# EAGLE schematic ESP32 Display-1.46-V1.0 (EAGLE 9.6.2)
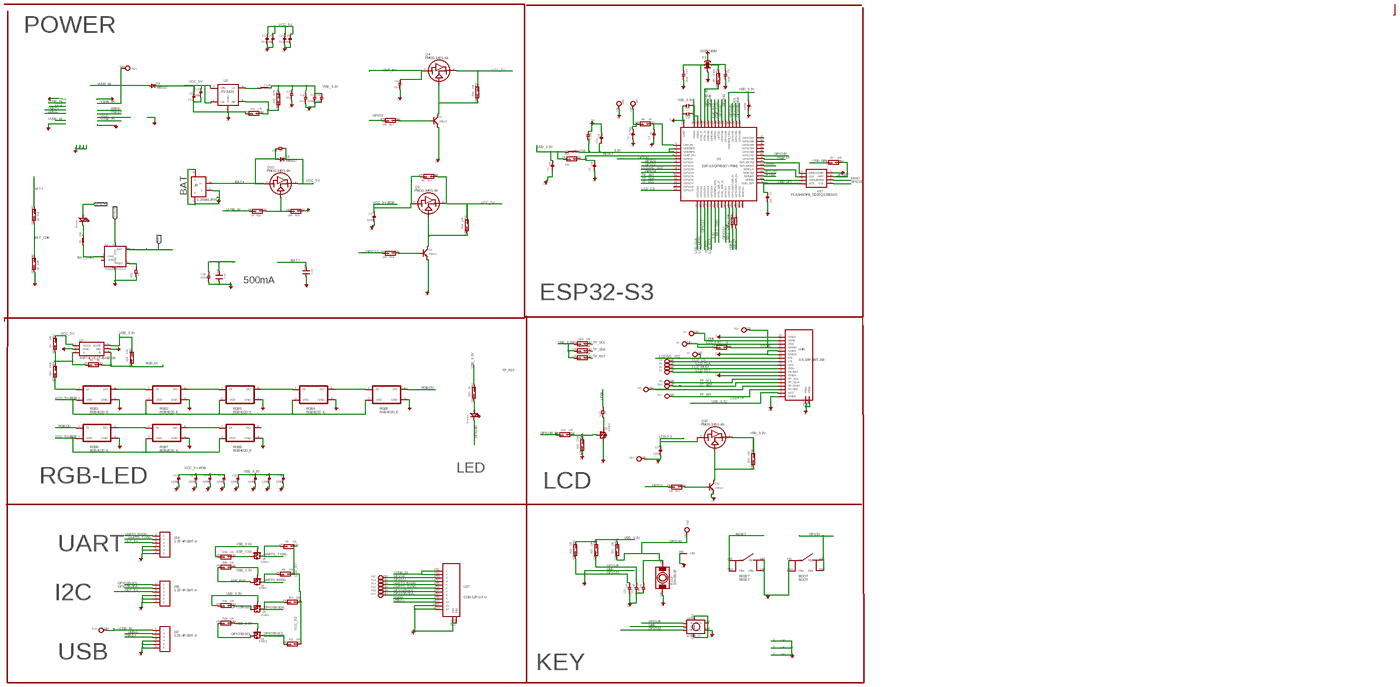
[diagram p0: schematic, sheet 1, overview]
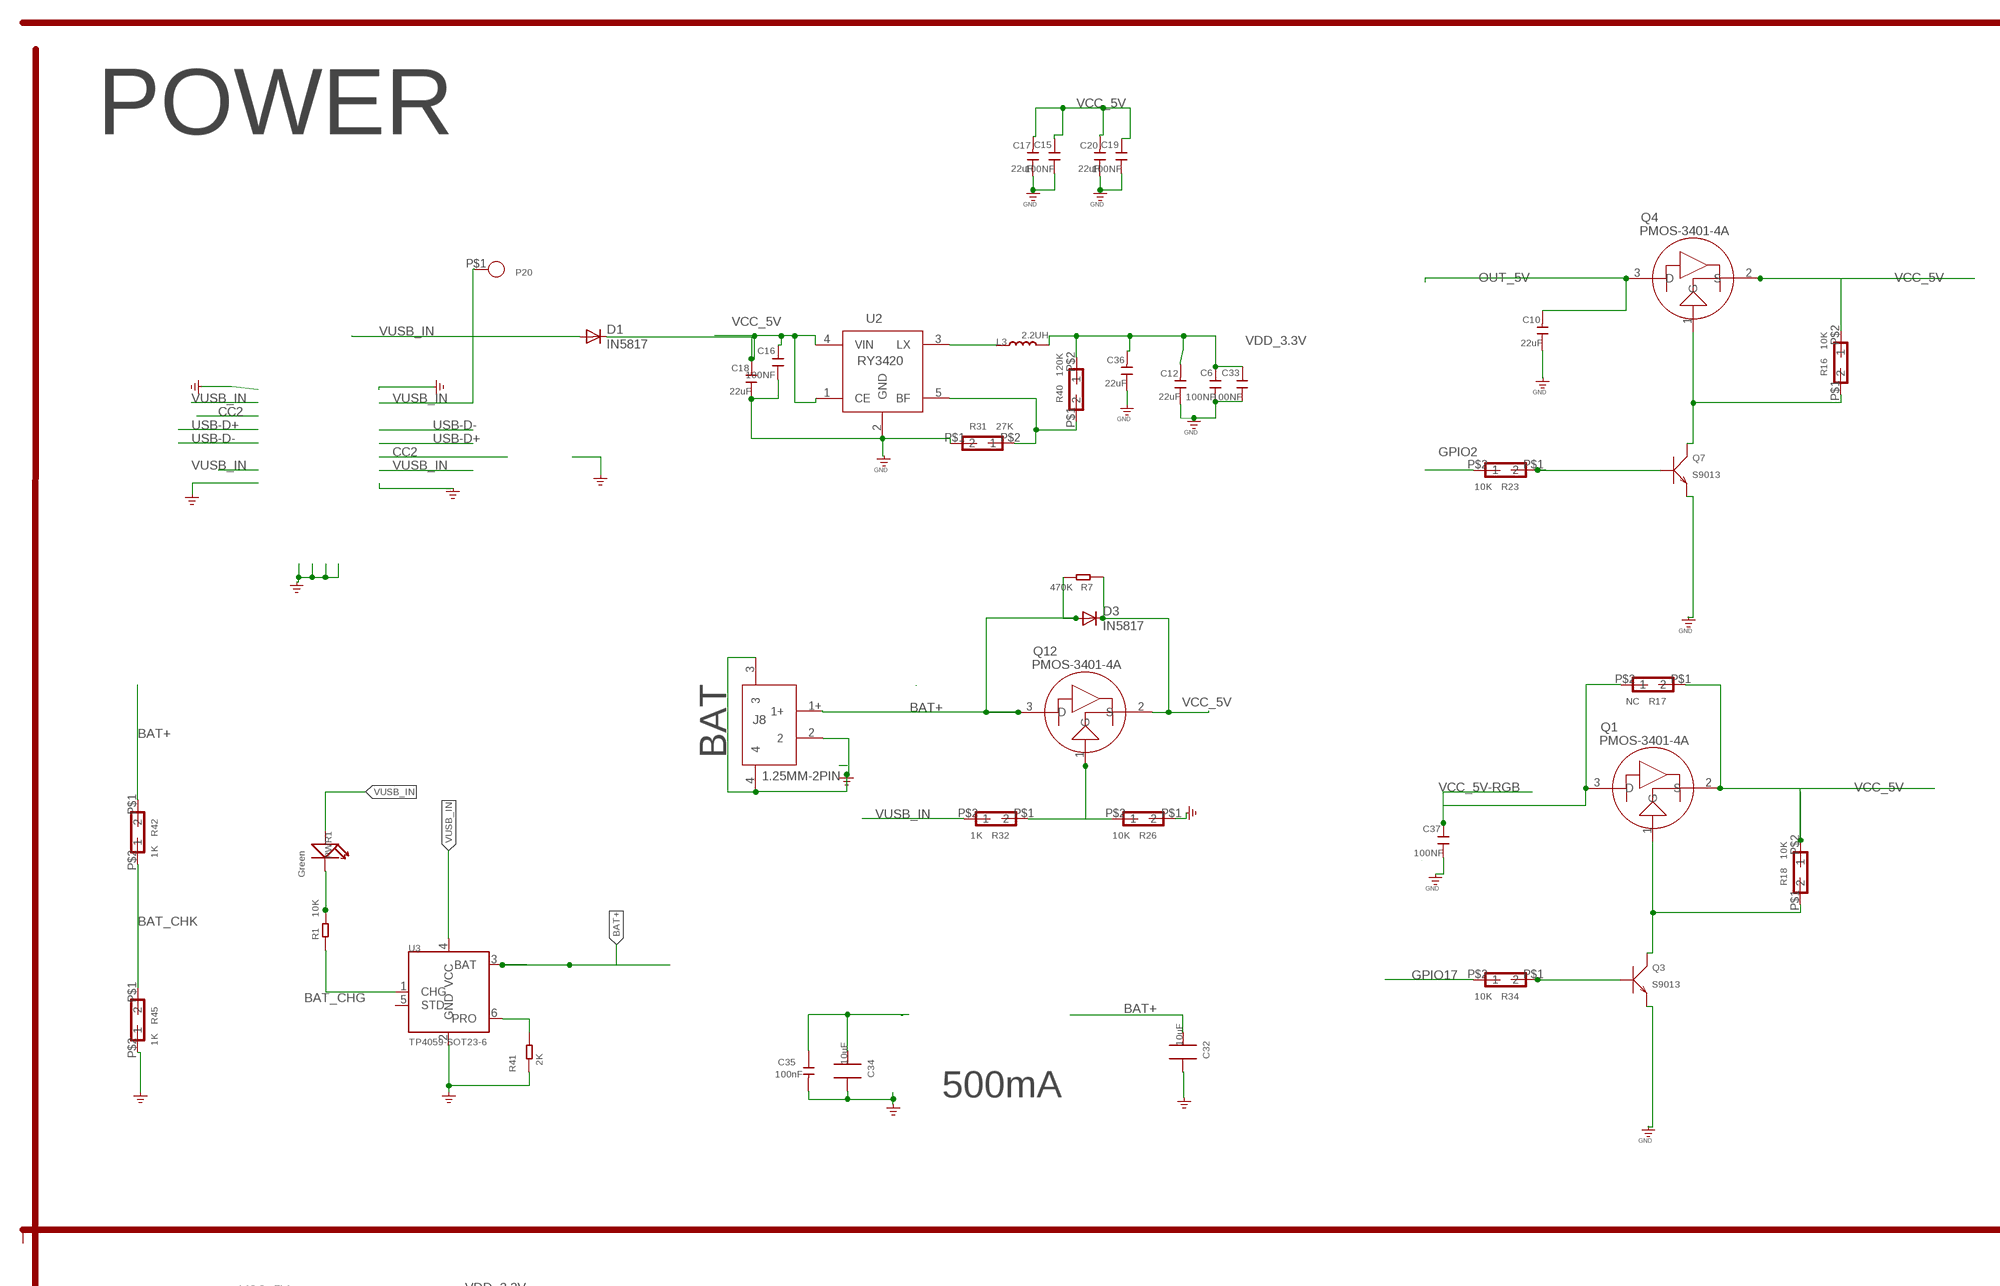
[diagram p1: schematic, sheet 1, part 1 of 5]
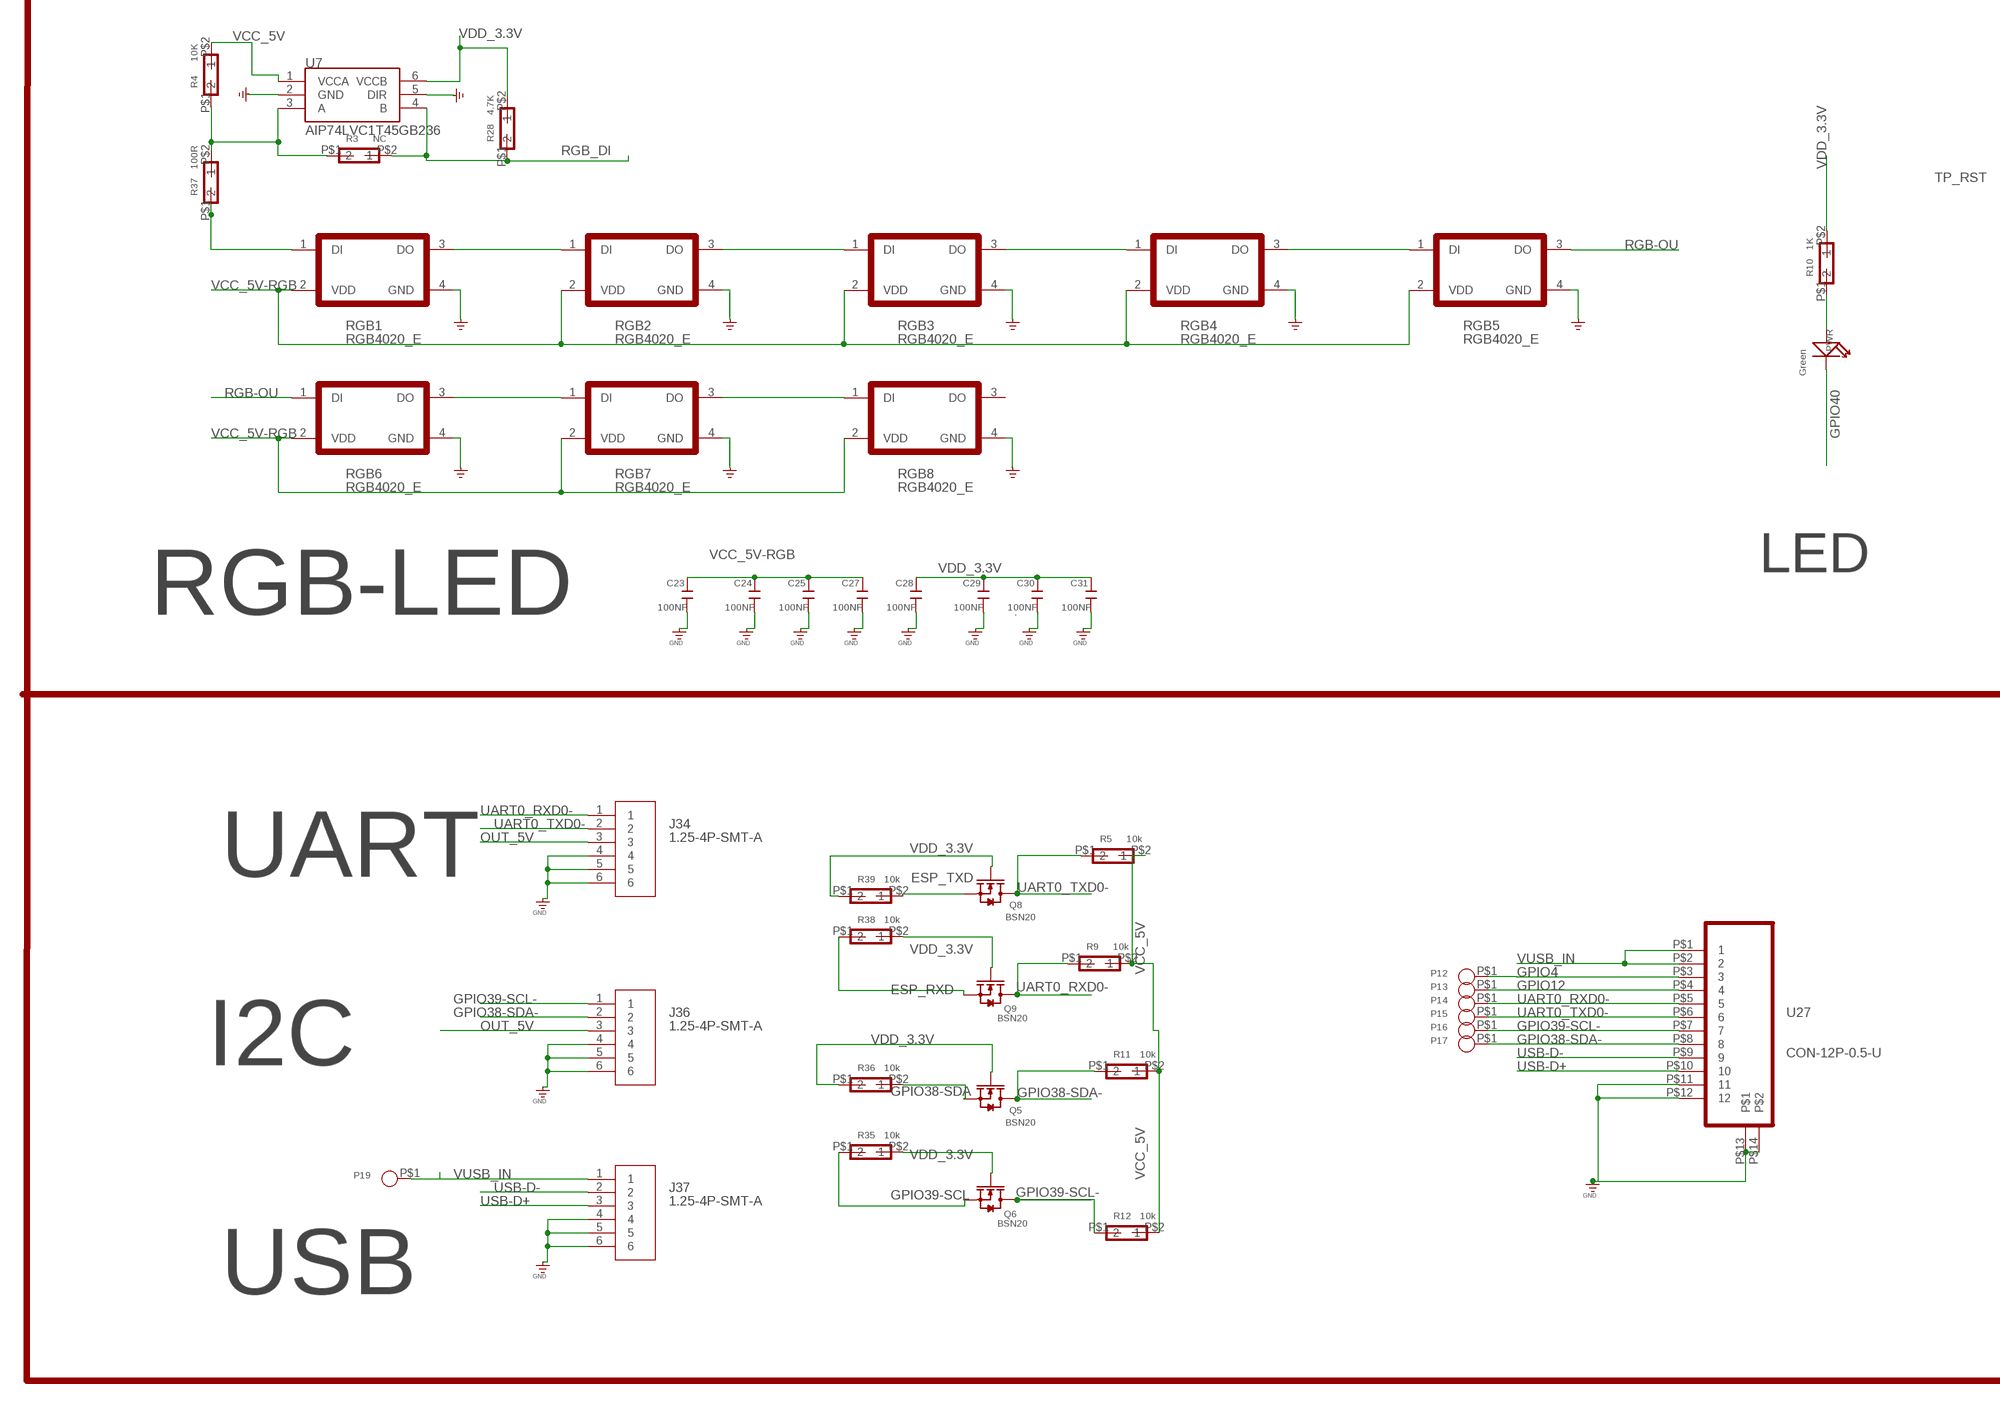
[diagram p2: schematic, sheet 1, part 2 of 5]
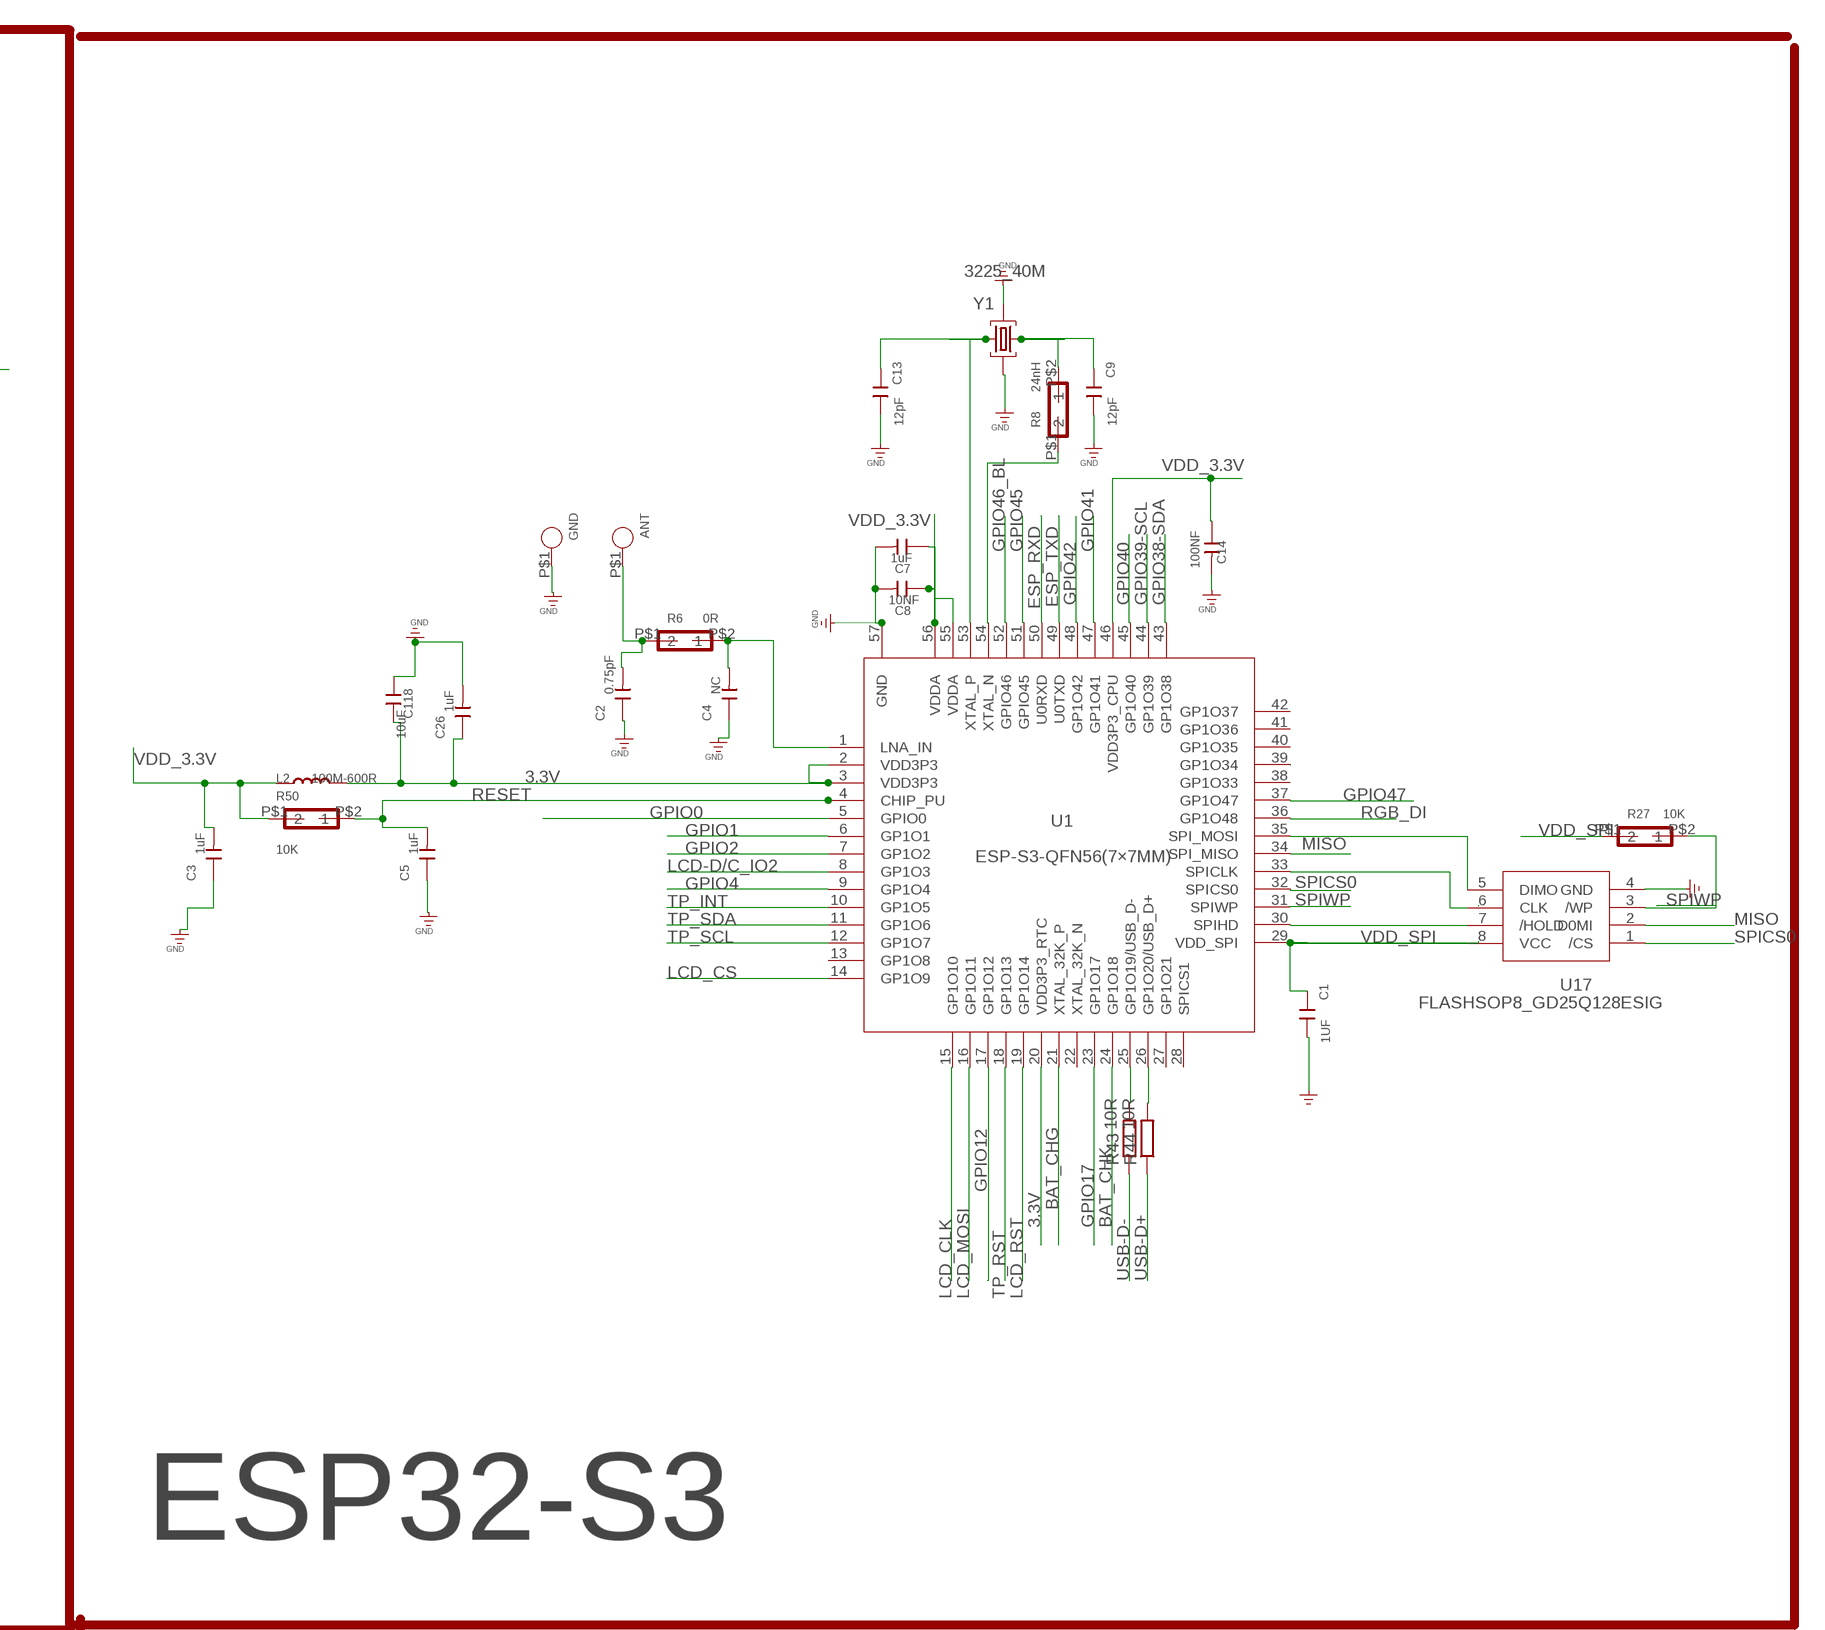
[diagram p3: schematic, sheet 1, part 3 of 5]
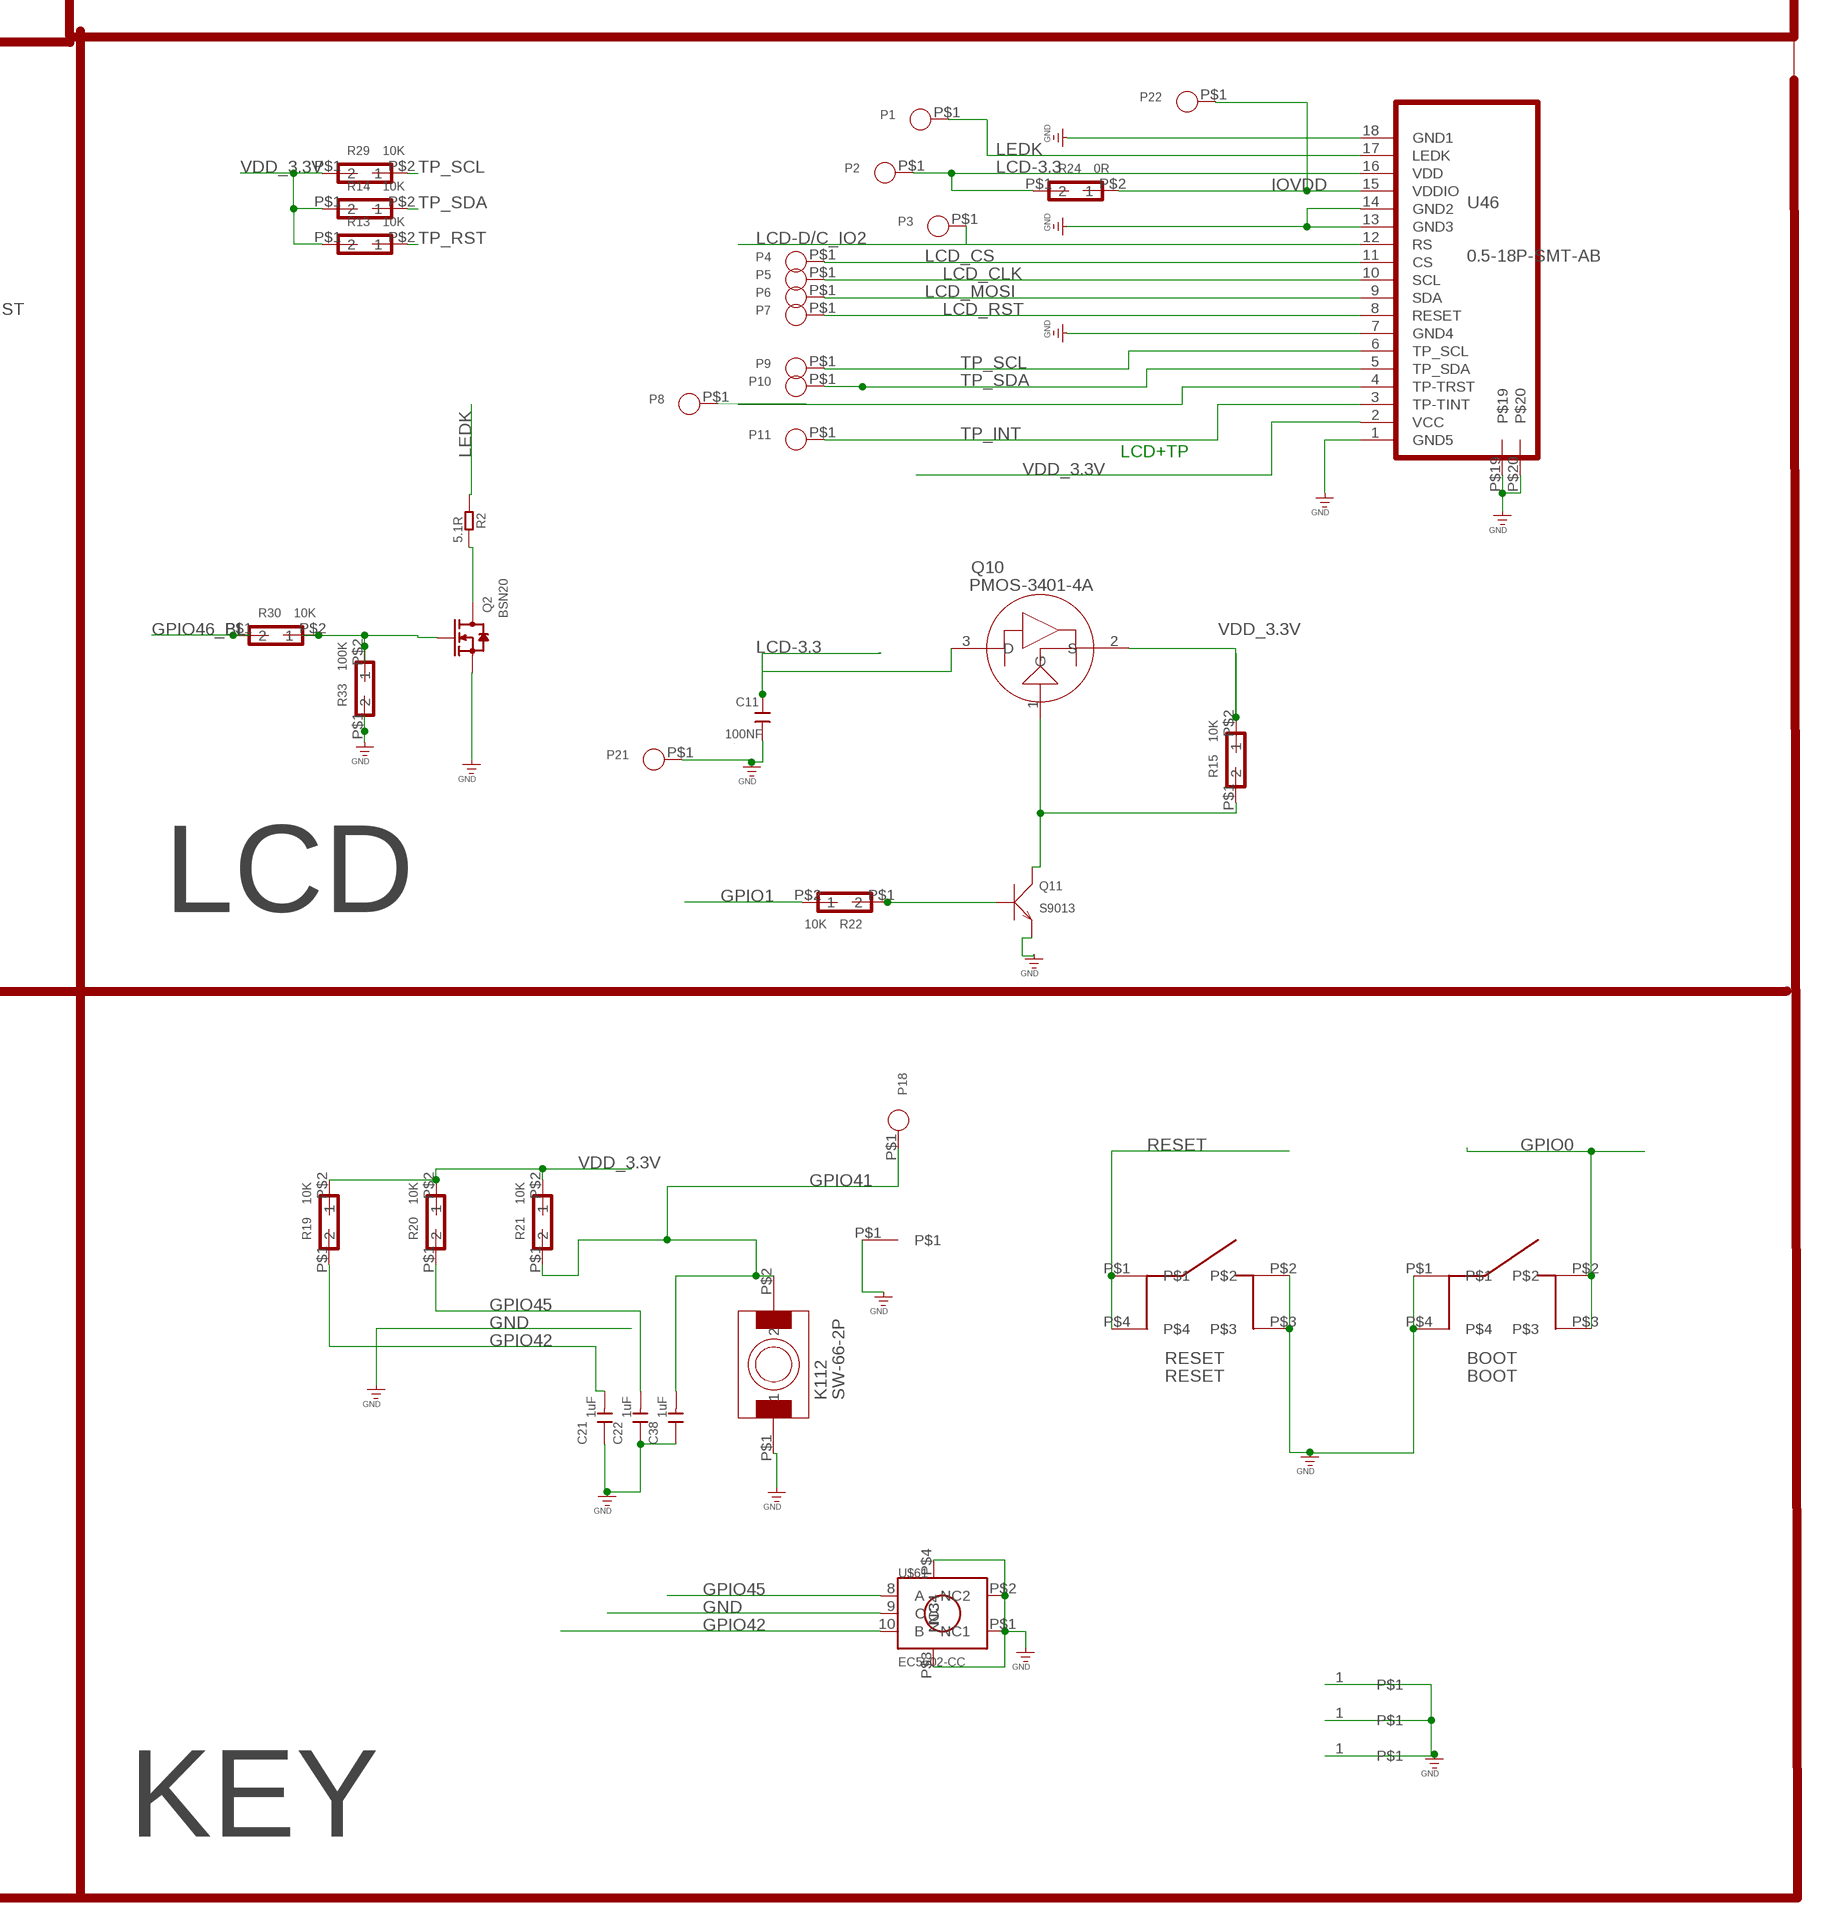
[diagram p4: schematic, sheet 1, part 4 of 5]
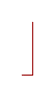
[diagram p5: schematic, sheet 1, part 5 of 5]

## Parts
ANT  TEST_PADPAD-1.5MM  [TEST_PAD-1.5MM]
BOOT  BOOT  SW-4  [SW-4.5*4.5]
C1  1UF  C0402_W  [0402]
C2  0.75pF  CAPC0402-1  [C0402]
C3  1uF  CAPC0402-1  [C0402]
C4  NC  CAPC0402-1  [C0402]
C5  1uF  CAPC0402-1  [C0402]
C6  100NF  C0603  [0603]
C7  1uF  C-0603  [C0603]
C8  10NF  C-0603  [C0603]
C9  12pF  C0402_W  [0402]
C10  22uF  C0805  [0805]
C11  100NF  C0603  [0603]
C12  22uF  C0805  [0805]
C13  12pF  C0402_W  [0402]
C14  100NF  C-0603  [C0603]
C15  100NF  C0603  [0603]
C16  100NF  C0603  [0603]
C17  22uF  C0805  [0805]
C18  22uF  C0805  [0805]
C19  100NF  C0603  [0603]
C20  22uF  C0805  [0805]
C21  1uF  CAPC0402-1  [C0402]
C22  1uF  CAPC0402-1  [C0402]
C23  100NF  C0603  [0603]
C24  100NF  C0603  [0603]
C25  100NF  C0603  [0603]
C26  1uF  CAPC0402-1  [C0402]
C27  100NF  C0603  [0603]
C28  100NF  C0603  [0603]
C29  100NF  C0603  [0603]
C30  100NF  C0603  [0603]
C31  100NF  C0603  [0603]
C32  10uF  C0805_S  [0805_S]
C33  100NF  C0603  [0603]
C34  10uF  C0805_S  [0805_S]
C35  100nF  C-0603  [C0603]
C36  22uF  C0805  [0805]
C37  100NF  C0603  [0603]
C38  1uF  CAPC0402-1  [C0402]
C118  10uF  C0603  [0603]
D1  IN5817  DIODE-DO-214AC  [DO-214AC]
D3  IN5817  DIODE-DO-214AC  [DO-214AC]
GND  TEST_PADPAD-1.5MM  [TEST_PAD-1.5MM]
J8  1.25MM-2PIN  CROWBOT-V1.0库_1.25MM-2PIN  [CROWBOT-V1.0库_1.25MM-2PIN]
J34  1.25-4P-SMT-A  [1.25-4P立贴]
J36  1.25-4P-SMT-A  [1.25-4P立贴]
J37  1.25-4P-SMT-A  [1.25-4P立贴]
K112  SW-66-2P  [CROWPI_POW_BUTTON_2P]
L2  100M-600R  L0603  [L0603]
L3  2.2UH  LL0420  [L0420]
P1  PADPAD-1.0MM  [PAD-1.0MM]
P2  PADPAD-1.0MM  [PAD-1.0MM]
P3  PADPAD-1.0MM  [PAD-1.0MM]
P4  PADPAD-1.0MM  [PAD-1.0MM]
P5  PADPAD-1.0MM  [PAD-1.0MM]
P6  PADPAD-1.0MM  [PAD-1.0MM]
P7  PADPAD-1.0MM  [PAD-1.0MM]
P8  PADPAD-1.0MM  [PAD-1.0MM]
P9  PADPAD-1.0MM  [PAD-1.0MM]
P10  PADPAD-1.0MM  [PAD-1.0MM]
P11  PADPAD-1.0MM  [PAD-1.0MM]
P12  PADPAD-1.0MM  [PAD-1.0MM]
P13  PADPAD-1.0MM  [PAD-1.0MM]
P14  PADPAD-1.0MM  [PAD-1.0MM]
P15  PADPAD-1.0MM  [PAD-1.0MM]
P16  PADPAD-1.0MM  [PAD-1.0MM]
P17  PADPAD-1.0MM  [PAD-1.0MM]
P18  PADPAD-1.0MM  [PAD-1.0MM]
P19  PADPAD-1.0MM  [PAD-1.0MM]
P20  PADPAD-1.0MM  [PAD-1.0MM]
P21  PADPAD-1.0MM  [PAD-1.0MM]
P22  PADPAD-1.0MM  [PAD-1.0MM]
PWR  Green  LED'0603'  [LED-0603]
PWR1  Green  LED'0603'  [LED-0603]
Q1  PMOS-3401-4A  P-MOS-SOT23  [SOT-23]
Q2  BSN20  MOSFET-N'SOT23'  [SOT23]
Q3  S9013  TRANSISTOR-NPN-SOT23  [SOT23@1]
Q4  PMOS-3401-4A  P-MOS-SOT23  [SOT-23]
Q5  BSN20  MOSFET-N'SOT23'  [SOT23]
Q6  BSN20  MOSFET-N'SOT23'  [SOT23]
Q7  S9013  TRANSISTOR-NPN-SOT23  [SOT23@1]
Q8  BSN20  MOSFET-N'SOT23'  [SOT23]
Q9  BSN20  MOSFET-N'SOT23'  [SOT23]
Q10  PMOS-3401-4A  P-MOS-SOT23  [SOT-23]
Q11  S9013  TRANSISTOR-NPN-SOT23  [SOT23@1]
Q12  PMOS-3401-4A  P-MOS-SOT23  [SOT-23]
R1  10K  RES-0402  [R0402]
R2  5.1R  R0603  [R0603]
R3  NC  R0402  [0402]
R4  10K  R0402  [0402]
R5  10k  R0402  [0402]
R6  0R  R0402  [0402]
R7  470K  RES-0402  [R0402]
R8  24nH  R0402  [0402]
R9  10k  R0402  [0402]
R10  1K  R0402  [0402]
R11  10k  R0402  [0402]
R12  10k  R0402  [0402]
R13  10K  R0402  [0402]
R14  10K  R0402  [0402]
R15  10K  R0402  [0402]
R16  10K  R0402  [0402]
R17  NC  R0402  [0402]
R18  10K  R0402  [0402]
R19  10K  R0402  [0402]
R20  10K  R0402  [0402]
R21  10K  R0402  [0402]
R22  10K  R0402  [0402]
R23  10K  R0402  [0402]
R24  0R  R0402  [0402]
R26  10K  R0402  [0402]
R27  10K  R0402  [0402]
R28  4.7K  R0402  [0402]
R29  10K  R0402  [0402]
R30  10K  R0402  [0402]
R31  27K  R0402  [0402]
R32  1K  R0402  [0402]
R33  100K  R0402  [0402]
R34  10K  R0402  [0402]
R35  10k  R0402  [0402]
R36  10k  R0402  [0402]
R37  100R  R0402  [0402]
R38  10k  R0402  [0402]
R39  10k  R0402  [0402]
R40  120K  R0402  [0402]
R41  2K  RES-0402  [R0402]
R42  1K  R0402  [0402]
R43  10R  R-EU_R0402  [R0402]
R44  10R  R-EU_R0402  [R0402]
R45  1K  R0402  [0402]
R50  10K  R0402  [0402]
RESET  RESET  SW-4  [SW-4.5*4.5]
RGB1  RGB4020_E  [RGB4020]
RGB2  RGB4020_E  [RGB4020]
RGB3  RGB4020_E  [RGB4020]
RGB4  RGB4020_E  [RGB4020]
RGB5  RGB4020_E  [RGB4020]
RGB6  RGB4020_E  [RGB4020]
RGB7  RGB4020_E  [RGB4020]
RGB8  RGB4020_E  [RGB4020]
T1  T2.5-A  [T-2.5]
T2  T2.5-A  [T-2.5]
T3  T2.5-A  [T-2.5]
U1  ESP-S3-QFN56(7×7MM)  [ESP-S3-QFN56(7×7MM)]
U2  RY3420  HX3406  [SOT23-5]
U3  TP4059-SOT23-6  [SOT23-6L]
U7  AIP74LVC1T45GB236  [SOT23-6L]
U17  FLASHSOP8_GD25Q128ESIG  FLASHSOP8_W25X20CL  [FLASHSOP8_SOP8]
U27  CON-12P-0.5-U  [CON-0.5-12P-U]
U46  0.5-18P-SMT-AB  [0.5MM-18P]
U$61  EC5602-CC  [EC5602-CC]
U$64  T-2-1.1  [T-2-1.1]
Y1  3225_40M  CRYSTAL-3.2-2.5  [CRYSTAL-3.2-2.5]

## Nets
3.3V: C26.1 C118.2 L2.2 U1.2(VDD3P3) U1.3(VDD3P3) U1.20(VDD3P3_RTC)
BAT+: C32.2 D3.A J8.1+ Q12.3(D) R7.1 R42.P$1 U3.3(BAT)
BAT_CHG: R1.2 U1.21(XTAL_32K_P) U3.1(CHG)
BAT_CHK: R42.P$2 R45.P$1 U1.24(GP1O18)
ESP_RXD: Q9.2(S) R38.P$1 U1.50(U0RXD)
ESP_TXD: Q8.2(S) R39.P$2 U1.49(U0TXD)
GND: BOOT.P$1 BOOT.P$4 C1.2 C2.1 C3.1 C4.1 C5.1 C6.2 C7.2 C8.2 C9.2 C10.1 C11.2 C12.1 C13.2 C14.2 C15.2 C16.2 C17.1 C18.1 C19.2 C20.1 C21.1 C22.1 C23.2 C24.2 C25.2 C26.2 C27.2 C28.2 C29.2 C30.2 C31.2 C32.1 C33.2 C34.1 C35.2 C36.1 C37.2 C38.1 C118.1 GND.P$1 J8.2 J8.3 J8.4 J34.4 J34.5 J34.6 J36.4 J36.5 J36.6 J37.4 J37.5 J37.6 K112.P$1 P21.P$1 Q2.2(S) Q3.2(E) Q7.2(E) Q11.2(E) R26.P$1 R31.P$1 R33.P$1 R41.1 R45.P$2 RESET.P$2 RESET.P$3 RGB1.4(GND) RGB2.4(GND) RGB3.4(GND) RGB4.4(GND) RGB5.4(GND) RGB6.4(GND) RGB7.4(GND) RGB8.4(GND) T1.1 T2.1 T3.1 U1.57(GND) U2.2(GND) U3.2(GND) U7.2(GND) U7.5(DIR) U17.4(GND) U27.P$11 U27.P$12 U27.P$13 U27.P$14 U46.1(GND5) U46.7(GND4) U46.13(GND3) U46.14(GND2) U46.18(GND1) U46.P$19 U46.P$20 U$61.9(C) U$61.P$1(NC1) U$61.P$2(NC2) U$61.P$3(NC3) U$61.P$4(NC4) U$64.P$1 Y1.2(GND) Y1.4(GND)
GPIO0: BOOT.P$2 BOOT.P$3 U1.5(GPIO0)
GPIO1: R22.P$2 U1.6(GP1O1)
GPIO2: R23.P$2 U1.7(GP1O2)
GPIO4: P12.P$1 U1.9(GP1O4) U27.P$3
GPIO12: P13.P$1 U1.17(GP1O12) U27.P$4
GPIO17: R34.P$2 U1.23(GP1O17)
GPIO34: U1.39(GP1O34)
GPIO37: U1.42(GP1O37)
GPIO38-SDA: Q5.2(S) R36.P$2 U1.43(GP1O38)
GPIO38-SDA-: J36.2 P17.P$1 Q5.3(D) R11.P$1 U27.P$8
GPIO39-SCL: Q6.2(S) R35.P$1 U1.44(GP1O39)
GPIO39-SCL-: J36.1 P16.P$1 Q6.3(D) R12.P$1 U27.P$7
GPIO40: PWR.- U1.45(GP1O40)
GPIO41: C38.2 K112.P$2 P18.P$1 R21.P$1 U1.47(GP1O41)
GPIO42: C21.2 R19.P$1 U1.48(GP1O42) U$61.10(B)
GPIO45: C22.2 R20.P$1 U1.51(GPIO45) U$61.8(A)
GPIO46_BL: R30.P$1 U1.52(GPIO46)
GPIO47: U1.37(GP1O47)
IOVDD: P22.P$1 R24.P$2 U46.15(VDDIO)
LCD-3.3: C11.1 P2.P$1 Q10.3(D) R24.P$1 U46.16(VDD)
LCD-D/C_IO2: P3.P$1 U1.8(GP1O3) U46.12(RS)
LCD_CLK: P5.P$1 U1.15(GP1O10) U46.10(SCL)
LCD_CS: P4.P$1 U1.14(GP1O9) U46.11(CS)
LCD_MOSI: P6.P$1 U1.16(GP1O11) U46.9(SDA)
LCD_RST: P7.P$1 U1.19(GP1O14) U46.8(RESET)
LEDK: P1.P$1 R2.2 U46.17(LEDK)
MISO: U1.34(SPI_MISO) U17.2(D0MI)
N$1: Q4.1(G) Q7.3(C) R16.P$1
N$2: RGB1.3(DO) RGB2.1(DI)
N$3: L3.1 U2.3(LX)
N$4: RGB2.3(DO) RGB3.1(DI)
N$5: PWR.+ R10.P$1
N$7: ANT.P$1 C2.2 R6.P$1
N$8: RGB3.3(DO) RGB4.1(DI)
N$10: R43.2 U1.25(GP1O19/USB_D-)
N$11: R41.2 U3.6(PRO)
N$12: Q12.1(G) R26.P$2 R32.P$1
N$13: Q2.3(D) R2.1
N$14: R31.P$2 R40.P$1 U2.5(BF)
N$15: Q2.1(G) R30.P$2 R33.P$2
N$16: R44.2 U1.26(GP1O20/USB_D+)
N$17: R3.P$1 R4.P$1 R37.P$2 U7.3(A)
N$18: R37.P$1 RGB1.1(DI)
N$19: U1.35(SPI_MOSI) U17.5(DIMO)
N$21: U1.33(SPICLK) U17.6(CLK)
N$22: RGB4.3(DO) RGB5.1(DI)
N$23: U1.30(SPIHD) U17.7(/HOLD)
N$26: Q10.1(G) Q11.3(C) R15.P$1
N$29: Q11.1(B) R22.P$1
N$30: Q7.1(B) R23.P$1
N$32: RGB6.3(DO) RGB7.1(DI)
N$33: RGB7.3(DO) RGB8.1(DI)
N$34: Q1.1(G) Q3.3(C) R18.P$1
N$39: Q3.1(B) R34.P$1
N$46: PWR1.- R1.1
N$48: C9.1 R8.P$2 Y1.1(C1)
N$49: R8.P$1 U1.54(XTAL_N)
N$198 [New Class]: C4.2 R6.P$2 U1.1(LNA_IN)
N$201: C13.1 U1.53(XTAL_P) Y1.3(C2)
OUT_5V: C10.2 J34.3 J36.3 Q4.3(D)
RESET: C5.2 R50.P$2 RESET.P$1 RESET.P$4 U1.4(CHIP_PU)
RGB-OU: RGB5.3(DO) RGB6.1(DI)
RGB_DI: R3.P$2 R28.P$1 U1.36(GP1O48) U7.4(B)
SPICS0: U1.32(SPICS0) U17.1(/CS)
SPIWP: R27.P$2 U1.31(SPIWP) U17.3(/WP)
TP_INT: P11.P$1 U1.10(GP1O5) U46.3(TP-TINT)
TP_RST: P8.P$1 R13.P$2 U1.18(GP1O13) U46.4(TP-TRST)
TP_SCL: P9.P$1 R29.P$2 U1.12(GP1O7) U46.6(TP_SCL)
TP_SDA: P10.P$1 R14.P$2 U1.11(GP1O6) U46.5(TP_SDA)
UART0_RXD0-: J34.1 P14.P$1 Q9.3(D) R9.P$1 U27.P$5
UART0_TXD0-: J34.2 P15.P$1 Q8.3(D) R5.P$1 U27.P$6
USB-D+: J37.3 R44.1 U27.P$10
USB-D-: J37.2 R43.1 U27.P$9
VCC_5V [PWR]: C15.1 C16.1 C17.2 C18.2 C19.1 C20.2 D1.C D3.C Q1.2(S) Q4.2(S) Q12.2(S) R4.P$2 R5.P$2 R7.2 R9.P$2 R11.P$2 R12.P$2 R16.P$2 R17.P$1 R18.P$2 U2.1(CE) U2.4(VIN) U7.1(VCCA)
VCC_5V-RGB [PWR]: C23.1 C24.1 C25.1 C27.1 C37.1 Q1.3(D) R17.P$2 RGB1.2(VDD) RGB2.2(VDD) RGB3.2(VDD) RGB4.2(VDD) RGB5.2(VDD) RGB6.2(VDD) RGB7.2(VDD) RGB8.2(VDD)
VDD_3.3V: C3.2 C6.1 C7.1 C8.1 C12.2 C14.1 C28.1 C29.1 C30.1 C31.1 C33.1 C36.2 L2.1 L3.2 Q5.1(G) Q6.1(G) Q8.1(G) Q9.1(G) Q10.2(S) R10.P$2 R13.P$1 R14.P$1 R15.P$2 R19.P$2 R20.P$2 R21.P$2 R28.P$2 R29.P$1 R35.P$2 R36.P$1 R38.P$2 R39.P$1 R40.P$2 R50.P$1 U1.46(VDD3P3_CPU) U1.55(VDDA) U1.56(VDDA) U7.6(VCCB) U46.2(VCC)
VDD_SPI: C1.1 R27.P$1 U1.29(VDD_SPI) U17.8(VCC)
VUSB_IN: C34.2 C35.1 D1.A J37.1 P19.P$1 P20.P$1 PWR1.+ R32.P$2 U3.4(VCC) U27.P$1 U27.P$2
Unconnected: RGB8.3(DO) U1.13(GP1O8) U1.22(XTAL_32K_N) U1.27(GP1O21) U1.28(SPICS1) U1.38(GP1O33) U1.40(GP1O35) U1.41(GP1O36) U3.5(STD)

## Notes on the sheet
- POWER
- BAT
- 500mA
- ESP32-S3
- LCD+TP
- LED
- RGB-LED | LCD
- UART
- I2C
- USB
- KEY

## Library data of the parts
ANT GND = CrowPanel_Advance_HMI:TEST_PAD*
BOOT RESET = DW1000:SW-4
C1 C9 C13 = WGH:C0402_W
C2-C5 C21 C22 C26 C38 = CrowPanel_Advance_HMI:CAP*
C6 C11 C15 C16 C19 C23-C25 C27-C31 C33 C37 C118 = cooper:C0603
C7 C8 C14 = Discrete:C*: Ceramic Capacitors
C10 C12 C17 C18 C20 C36 = A_xbj:C0805
C32 C34 = CPT_SMD:C0805
C35 = discrete:C*: Ceramic Capacitors
D1 D3 = diode:DIODE-: DIODE
J8 = CrowBot_-V1.2-20220713:CROWBOT-V1.0库_1.25MM-2PIN
J34 J36 J37 = DW1000:1.25-4P-SMT-A
K112 = ESP32_Display_2.1(K)_Main_V1.1:SW-6*6-2P
L2 L3 = Lora_RA-08H_Node_ Board:L*
P1-P22 = crowpi_pow:PAD*
PWR PWR1 = discrete:LED*
Q1 Q4 Q10 Q12 = DFN8:P-MOS-SOT23
Q2 Q5 Q6 Q8 Q9 = discrete:MOSFET-N: IRLL014: http://www.vishay.com/docs/91319/sihll014.pdf
Q3 Q7 Q11 = discrete:TRANSISTOR-NPN*: NPN audion
R1 R7 R41 = SX1302_Module:RES*
R2 = cooper:R0603
R3-R6 R8-R24 R26-R40 R42 R45 R50 = DW1000:R0402
R43 R44 = rcl:R-EU_: RESISTOR, European symbol; SPICEPREFIX: R
RGB1-RGB8 = DW1000:RGB4020_E
T1-T3 = DW1000:T2.5-A
U1 = DA14580_40p:ESP-S3-QFN56(7×7MM)
U2 = DFN8:HX3406
U3 = CrowPanel_Advance_HMI:TP4059-SOT23-6
U7 = Mechanical_Keyboard:AIP74LVC1T45GB236
U17 = ESP32 Display-1.28:FLASHSOP8_W25X20CL
U27 = DW1000:CON-12P-0.5-U
U46 = DW1000:0.5-18P-SMT-AB
U$61 = ESP32_Display_K:EC5602-CC
U$64 = DW1000:T-2-1.1
Y1 = SmartPrj:CRYSTAL-3.2-2.5

## Net classes
0 default: width 0.152 mm, drill 0.254 mm, clearance 0.15 mm
1 PWR: width 0.254 mm, drill 0.254 mm, clearance 0.15 mm to class 0, clearance 0.5 mm
2 GND: width 0.254 mm, drill 0.305 mm, clearance 0.305 mm to class 0, clearance 0.508 mm to class 1, clearance 0.508 mm
3 New Class: width 0.152 mm, drill 0.152 mm, clearance 0.152 mm to class 0, clearance 0.152 mm to class 1, clearance 0.152 mm to class 2, clearance 0.152 mm